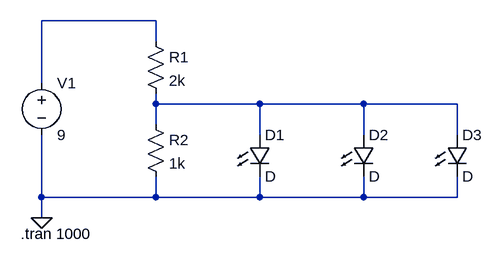
[diagram p0: schematic laser_diode_emitter.asc]
laser_diode_emitter.asc, the LTspice schematic file:
Version 4
SHEET 1 880 680
WIRE 256 16 80 16
WIRE 256 48 256 16
WIRE 80 112 80 16
WIRE 256 144 256 128
WIRE 416 144 256 144
WIRE 576 144 416 144
WIRE 720 144 576 144
WIRE 256 176 256 144
WIRE 416 192 416 144
WIRE 576 192 576 144
WIRE 720 192 720 144
WIRE 80 288 80 192
WIRE 256 288 256 256
WIRE 256 288 80 288
WIRE 416 288 416 256
WIRE 416 288 256 288
WIRE 576 288 576 256
WIRE 576 288 416 288
WIRE 720 288 720 256
WIRE 720 288 576 288
WIRE 80 320 80 288
FLAG 80 320 0
SYMBOL voltage 80 96 R0
WINDOW 123 0 0 Left 0
WINDOW 39 0 0 Left 0
SYMATTR InstName V1
SYMATTR Value 9
SYMBOL res 240 32 R0
SYMATTR InstName R1
SYMATTR Value 2k
SYMBOL res 240 160 R0
SYMATTR InstName R2
SYMATTR Value 1k
SYMBOL LED 400 192 R0
SYMATTR InstName D1
SYMBOL LED 560 192 R0
SYMATTR InstName D2
SYMBOL LED 704 192 R0
SYMATTR InstName D3
TEXT 48 344 Left 2 !.tran 1000

The netlist it stands for:
* laser_diode_emitter.asc
V1 N001 0 9
R1 N001 N002 2k
R2 N002 0 1k
D1 N002 0 D
D2 N002 0 D
D3 N002 0 D
.model D D
.lib standard.dio
.tran 1000
.backanno
.end